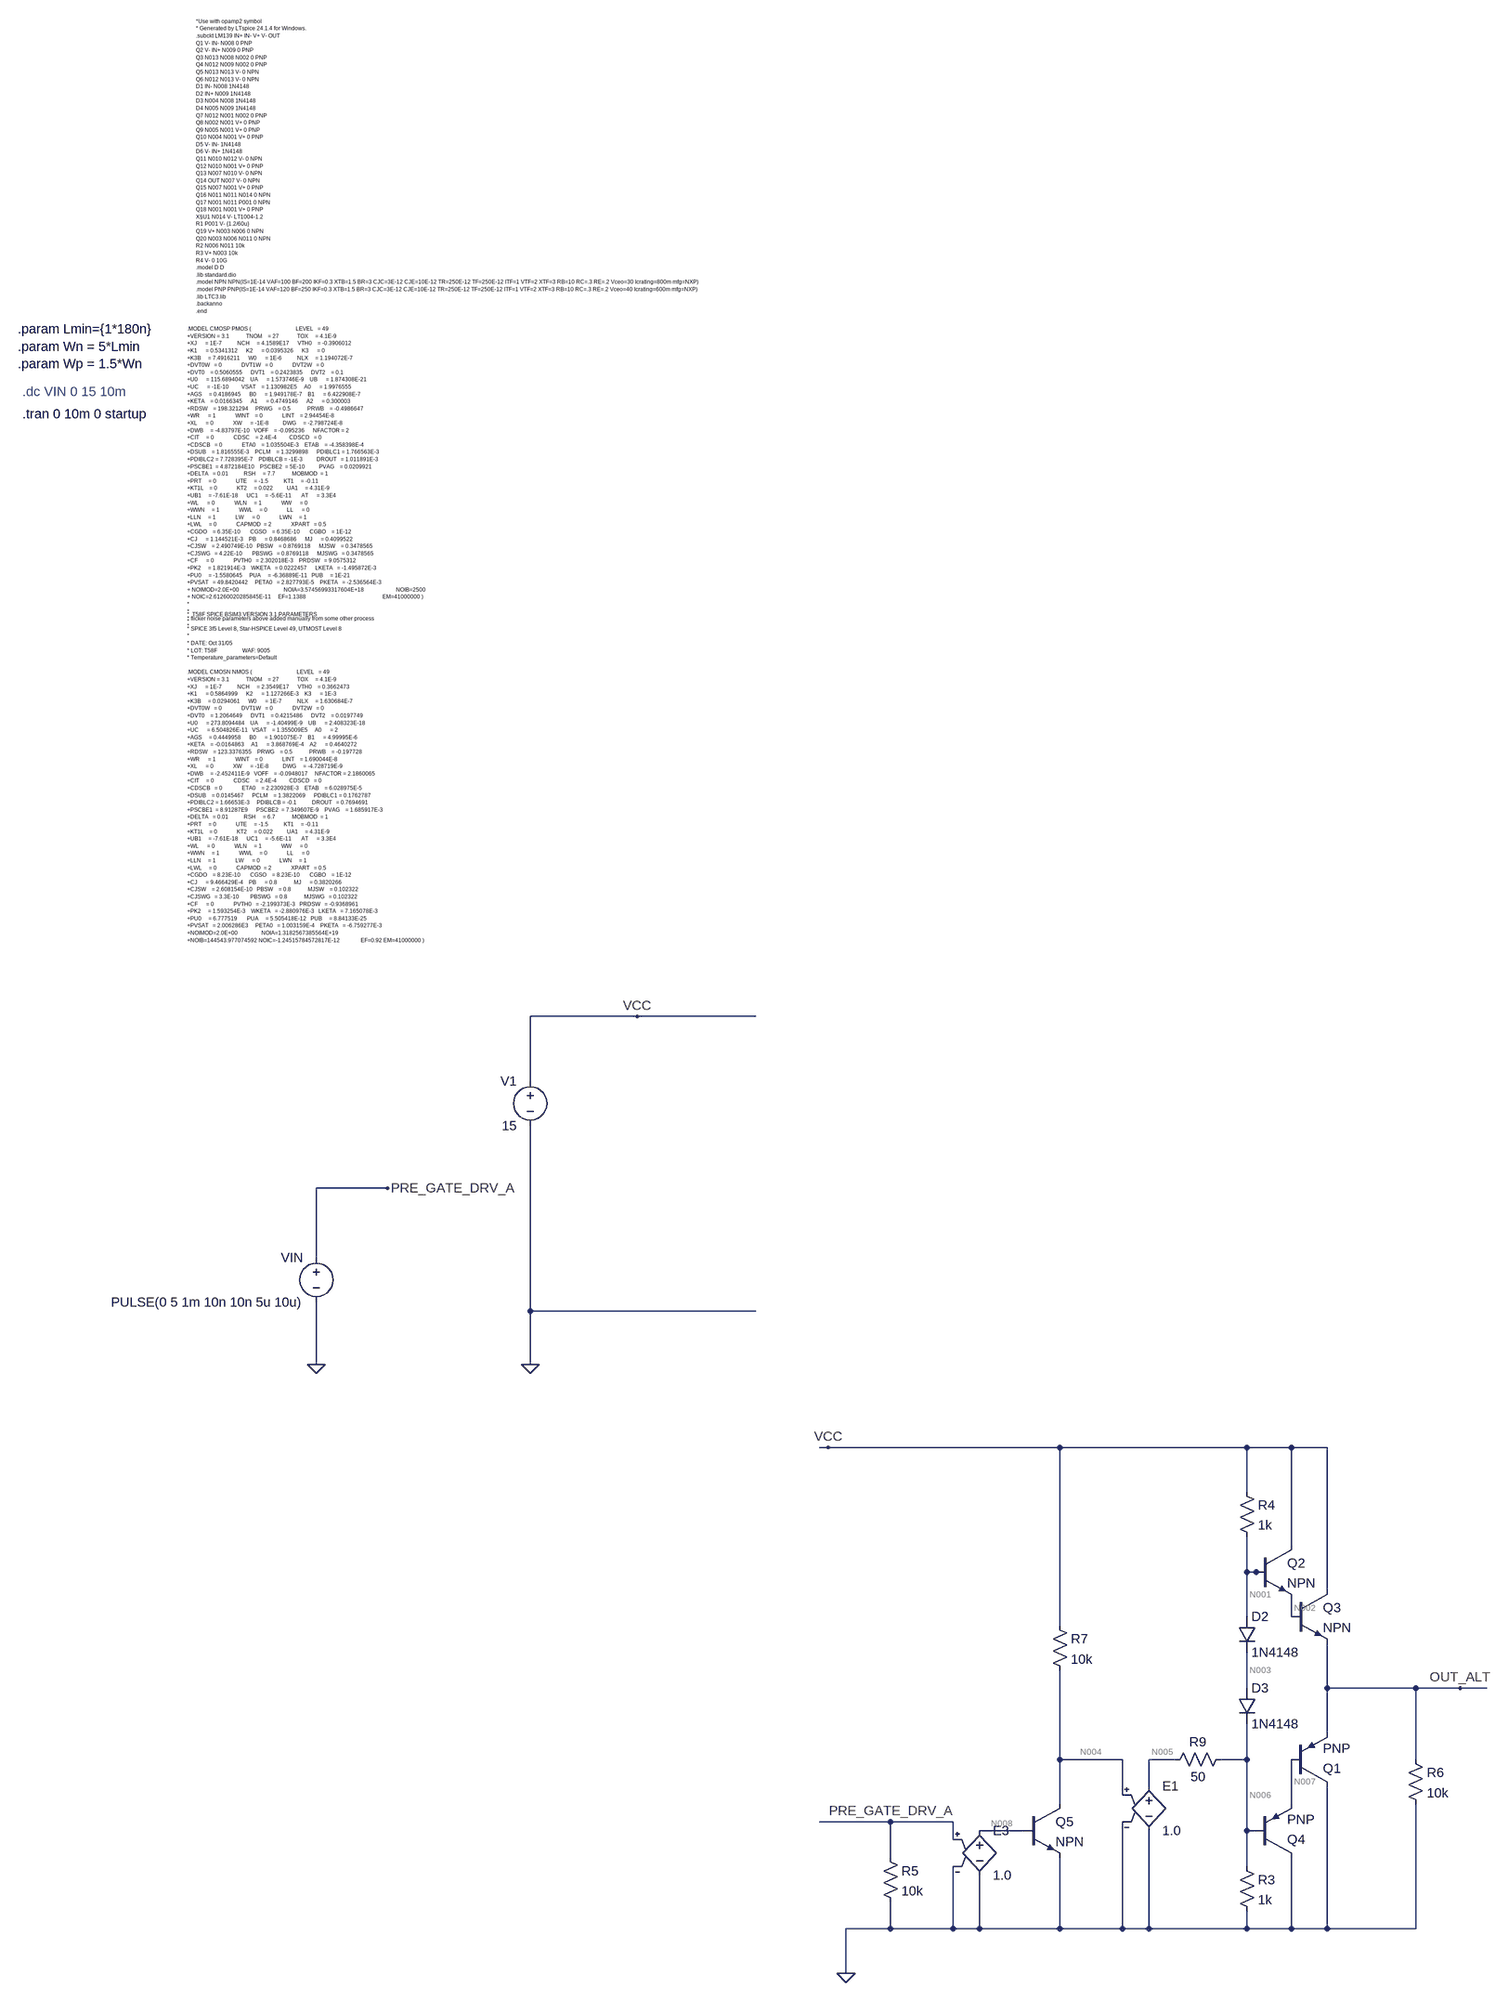
[diagram p0: schematic Output_Stage_Alternative.asc]
Output_Stage_Alternative.asc, the LTspice schematic file:
Version 4.1
SHEET 1 6960 2676
WIRE 672 480 480 480
WIRE 1008 480 672 480
WIRE 480 928 480 480
WIRE 224 1120 96 1120
WIRE 96 1248 96 1120
WIRE 480 1344 480 1008
WIRE 1008 1344 480 1344
WIRE 96 1440 96 1328
WIRE 480 1440 480 1344
WIRE 1760 1712 1744 1712
WIRE 2176 1712 1760 1712
WIRE 2512 1712 2176 1712
WIRE 2592 1712 2512 1712
WIRE 2656 1712 2592 1712
WIRE 2512 1792 2512 1712
WIRE 2592 1888 2592 1712
WIRE 2512 1936 2512 1872
WIRE 2528 1936 2512 1936
WIRE 2544 1936 2528 1936
WIRE 2656 1968 2656 1712
WIRE 2512 2016 2512 1936
WIRE 2592 2016 2592 1984
WIRE 2176 2032 2176 1712
WIRE 2512 2144 2512 2080
WIRE 2656 2144 2656 2064
WIRE 3008 2144 2656 2144
WIRE 3088 2144 3008 2144
WIRE 3136 2144 3088 2144
WIRE 2656 2224 2656 2144
WIRE 2176 2272 2176 2112
WIRE 2288 2272 2176 2272
WIRE 2384 2272 2336 2272
WIRE 2512 2272 2512 2208
WIRE 2512 2272 2464 2272
WIRE 3008 2272 3008 2144
WIRE 2336 2320 2336 2272
WIRE 2288 2336 2288 2272
WIRE 2176 2352 2176 2272
WIRE 2592 2352 2592 2272
WIRE 1872 2384 1744 2384
WIRE 1984 2384 1872 2384
WIRE 2112 2400 2032 2400
WIRE 2512 2400 2512 2272
WIRE 2528 2400 2512 2400
WIRE 1984 2416 1984 2384
WIRE 1872 2448 1872 2384
WIRE 2512 2464 2512 2400
WIRE 1872 2576 1872 2528
WIRE 1872 2576 1792 2576
WIRE 1984 2576 1984 2464
WIRE 1984 2576 1872 2576
WIRE 2032 2576 2032 2480
WIRE 2032 2576 1984 2576
WIRE 2176 2576 2176 2448
WIRE 2176 2576 2032 2576
WIRE 2288 2576 2288 2384
WIRE 2288 2576 2176 2576
WIRE 2336 2576 2336 2400
WIRE 2336 2576 2288 2576
WIRE 2512 2576 2512 2544
WIRE 2512 2576 2336 2576
WIRE 2592 2576 2592 2448
WIRE 2592 2576 2512 2576
WIRE 2656 2576 2656 2320
WIRE 2656 2576 2592 2576
WIRE 3008 2576 3008 2352
WIRE 3008 2576 2656 2576
WIRE 1792 2656 1792 2576
FLAG 480 1440 0
FLAG 96 1440 0
FLAG 224 1120 PRE_GATE_DRV_A
FLAG 672 480 VCC
FLAG 1872 2384 PRE_GATE_DRV_A
FLAG 3088 2144 OUT_ALT
FLAG 1792 2656 0
FLAG 1760 1712 VCC
SYMBOL voltage 480 912 M0
WINDOW 123 0 0 Left 0
WINDOW 39 0 0 Left 0
SYMATTR InstName V1
SYMATTR Value 15
SYMBOL voltage 96 1232 M0
WINDOW 123 0 0 Left 0
WINDOW 39 0 0 Left 0
SYMATTR InstName VIN
SYMATTR Value PULSE(0 5 1m 10n 10n 5u 10u)
SYMBOL npn 2528 1888 R0
SYMATTR InstName Q2
SYMBOL npn 2592 1968 R0
SYMATTR InstName Q3
SYMBOL diode 2496 2016 R0
SYMATTR InstName D2
SYMATTR Value 1N4148
SYMBOL e 2336 2304 R0
SYMATTR InstName E1
SYMATTR Value 1.0
SYMBOL res 1856 2432 R0
SYMATTR InstName R5
SYMATTR Value 10k
SYMBOL res 2992 2256 R0
SYMATTR InstName R6
SYMATTR Value 10k
SYMBOL pnp 2592 2320 M180
SYMATTR InstName Q1
SYMBOL pnp 2528 2448 M180
SYMATTR InstName Q4
SYMBOL diode 2496 2144 R0
SYMATTR InstName D3
SYMATTR Value 1N4148
SYMBOL res 2496 2448 R0
SYMATTR InstName R3
SYMATTR Value 1k
SYMBOL res 2496 1776 R0
SYMATTR InstName R4
SYMATTR Value 1k
SYMBOL npn 2112 2352 R0
SYMATTR InstName Q5
SYMBOL res 2160 2016 R0
SYMATTR InstName R7
SYMATTR Value 10k
SYMBOL e 2032 2384 R0
SYMATTR InstName E3
SYMATTR Value 1.0
SYMBOL res 2480 2256 R90
WINDOW 0 0 56 VBottom 2
WINDOW 3 32 56 VTop 2
SYMATTR InstName R9
SYMATTR Value 50
TEXT -136 -880 Left 0 !.MODEL CMOSP PMOS (                                LEVEL   = 49\n+VERSION = 3.1            TNOM    = 27             TOX     = 4.1E-9\n+XJ      = 1E-7           NCH     = 4.1589E17      VTH0    = -0.3906012\n+K1      = 0.5341312      K2      = 0.0395326      K3      = 0\n+K3B     = 7.4916211      W0      = 1E-6           NLX     = 1.194072E-7\n+DVT0W   = 0              DVT1W   = 0              DVT2W   = 0\n+DVT0    = 0.5060555      DVT1    = 0.2423835      DVT2    = 0.1\n+U0      = 115.6894042    UA      = 1.573746E-9    UB      = 1.874308E-21\n+UC      = -1E-10         VSAT    = 1.130982E5     A0      = 1.9976555\n+AGS     = 0.4186945      B0      = 1.949178E-7    B1      = 6.422908E-7\n+KETA    = 0.0166345      A1      = 0.4749146      A2      = 0.300003\n+RDSW    = 198.321294     PRWG    = 0.5            PRWB    = -0.4986647\n+WR      = 1              WINT    = 0              LINT    = 2.94454E-8\n+XL      = 0              XW      = -1E-8          DWG     = -2.798724E-8\n+DWB     = -4.83797E-10   VOFF    = -0.095236      NFACTOR = 2\n+CIT     = 0              CDSC    = 2.4E-4         CDSCD   = 0\n+CDSCB   = 0              ETA0    = 1.035504E-3    ETAB    = -4.358398E-4\n+DSUB    = 1.816555E-3    PCLM    = 1.3299898      PDIBLC1 = 1.766563E-3\n+PDIBLC2 = 7.728395E-7    PDIBLCB = -1E-3          DROUT   = 1.011891E-3\n+PSCBE1  = 4.872184E10    PSCBE2  = 5E-10          PVAG    = 0.0209921\n+DELTA   = 0.01           RSH     = 7.7            MOBMOD  = 1\n+PRT     = 0              UTE     = -1.5           KT1     = -0.11\n+KT1L    = 0              KT2     = 0.022          UA1     = 4.31E-9\n+UB1     = -7.61E-18      UC1     = -5.6E-11       AT      = 3.3E4\n+WL      = 0              WLN     = 1              WW      = 0\n+WWN     = 1              WWL     = 0              LL      = 0\n+LLN     = 1              LW      = 0              LWN     = 1\n+LWL     = 0              CAPMOD  = 2              XPART   = 0.5\n+CGDO    = 6.35E-10       CGSO    = 6.35E-10       CGBO    = 1E-12\n+CJ      = 1.144521E-3    PB      = 0.8468686      MJ      = 0.4099522\n+CJSW    = 2.490749E-10   PBSW    = 0.8769118      MJSW    = 0.3478565\n+CJSWG   = 4.22E-10       PBSWG   = 0.8769118      MJSWG   = 0.3478565\n+CF      = 0              PVTH0   = 2.302018E-3    PRDSW   = 9.0575312\n+PK2     = 1.821914E-3    WKETA   = 0.0222457      LKETA   = -1.495872E-3\n+PU0     = -1.5580645     PUA     = -6.36889E-11   PUB     = 1E-21\n+PVSAT   = 49.8420442     PETA0   = 2.827793E-5    PKETA   = -2.536564E-3 \n+ NOIMOD=2.0E+00                                NOIA=3.57456993317604E+18                       NOIB=2500\n+ NOIC=2.61260020285845E-11     EF=1.1388                                                       EM=41000000 )\n*\n*\n* flicker noise parameters above added manually from some other process\n*
TEXT -440 -880 Left 2 !.param Lmin={1*180n}\n.param Wn = 5*Lmin\n.param Wp = 1.5*Wn
TEXT -432 -768 Left 2 ;.dc VIN 0 15 10m
TEXT -432 -728 Left 2 !.tran 0 10m 0 startup
TEXT -136 -368 Left 0 !*  T58F SPICE BSIM3 VERSION 3.1 PARAMETERS\n* \n* SPICE 3f5 Level 8, Star-HSPICE Level 49, UTMOST Level 8\n* \n* DATE: Oct 31/05\n* LOT: T58F                  WAF: 9005\n* Temperature_parameters=Default\n \n.MODEL CMOSN NMOS (                                LEVEL   = 49\n+VERSION = 3.1            TNOM    = 27             TOX     = 4.1E-9\n+XJ      = 1E-7           NCH     = 2.3549E17      VTH0    = 0.3662473\n+K1      = 0.5864999      K2      = 1.127266E-3    K3      = 1E-3\n+K3B     = 0.0294061      W0      = 1E-7           NLX     = 1.630684E-7\n+DVT0W   = 0              DVT1W   = 0              DVT2W   = 0\n+DVT0    = 1.2064649      DVT1    = 0.4215486      DVT2    = 0.0197749\n+U0      = 273.8094484    UA      = -1.40499E-9    UB      = 2.408323E-18\n+UC      = 6.504826E-11   VSAT    = 1.355009E5     A0      = 2\n+AGS     = 0.4449958      B0      = 1.901075E-7    B1      = 4.99995E-6\n+KETA    = -0.0164863     A1      = 3.868769E-4    A2      = 0.4640272\n+RDSW    = 123.3376355    PRWG    = 0.5            PRWB    = -0.197728\n+WR      = 1              WINT    = 0              LINT    = 1.690044E-8\n+XL      = 0              XW      = -1E-8          DWG     = -4.728719E-9\n+DWB     = -2.452411E-9   VOFF    = -0.0948017     NFACTOR = 2.1860065\n+CIT     = 0              CDSC    = 2.4E-4         CDSCD   = 0\n+CDSCB   = 0              ETA0    = 2.230928E-3    ETAB    = 6.028975E-5\n+DSUB    = 0.0145467      PCLM    = 1.3822069      PDIBLC1 = 0.1762787\n+PDIBLC2 = 1.66653E-3     PDIBLCB = -0.1           DROUT   = 0.7694691\n+PSCBE1  = 8.91287E9      PSCBE2  = 7.349607E-9    PVAG    = 1.685917E-3\n+DELTA   = 0.01           RSH     = 6.7            MOBMOD  = 1\n+PRT     = 0              UTE     = -1.5           KT1     = -0.11\n+KT1L    = 0              KT2     = 0.022          UA1     = 4.31E-9\n+UB1     = -7.61E-18      UC1     = -5.6E-11       AT      = 3.3E4\n+WL      = 0              WLN     = 1              WW      = 0\n+WWN     = 1              WWL     = 0              LL      = 0\n+LLN     = 1              LW      = 0              LWN     = 1\n+LWL     = 0              CAPMOD  = 2              XPART   = 0.5\n+CGDO    = 8.23E-10       CGSO    = 8.23E-10       CGBO    = 1E-12\n+CJ      = 9.466429E-4    PB      = 0.8            MJ      = 0.3820266\n+CJSW    = 2.608154E-10   PBSW    = 0.8            MJSW    = 0.102322\n+CJSWG   = 3.3E-10        PBSWG   = 0.8            MJSWG   = 0.102322\n+CF      = 0              PVTH0   = -2.199373E-3   PRDSW   = -0.9368961\n+PK2     = 1.593254E-3    WKETA   = -2.880976E-3   LKETA   = 7.165078E-3\n+PU0     = 6.777519       PUA     = 5.505418E-12   PUB     = 8.84133E-25\n+PVSAT   = 2.006286E3     PETA0   = 1.003159E-4    PKETA   = -6.759277E-3\n+NOIMOD=2.0E+00                 NOIA=1.3182567385564E+19\n+NOIB=144543.977074592 NOIC=-1.24515784572817E-12               EF=0.92 EM=41000000 )
TEXT -120 -1432 Left 0 !*Use with opamp2 symbol\n* Generated by LTspice 24.1.4 for Windows.\n.subckt LM139 IN+ IN- V+ V- OUT\nQ1 V- IN- N008 0 PNP\nQ2 V- IN+ N009 0 PNP\nQ3 N013 N008 N002 0 PNP\nQ4 N012 N009 N002 0 PNP\nQ5 N013 N013 V- 0 NPN\nQ6 N012 N013 V- 0 NPN\nD1 IN- N008 1N4148\nD2 IN+ N009 1N4148\nD3 N004 N008 1N4148\nD4 N005 N009 1N4148\nQ7 N012 N001 N002 0 PNP\nQ8 N002 N001 V+ 0 PNP\nQ9 N005 N001 V+ 0 PNP\nQ10 N004 N001 V+ 0 PNP\nD5 V- IN- 1N4148\nD6 V- IN+ 1N4148\nQ11 N010 N012 V- 0 NPN\nQ12 N010 N001 V+ 0 PNP\nQ13 N007 N010 V- 0 NPN\nQ14 OUT N007 V- 0 NPN\nQ15 N007 N001 V+ 0 PNP\nQ16 N011 N011 N014 0 NPN\nQ17 N001 N011 P001 0 NPN\nQ18 N001 N001 V+ 0 PNP\nX§U1 N014 V- LT1004-1.2\nR1 P001 V- {1.2/60u}\nQ19 V+ N003 N006 0 NPN\nQ20 N003 N006 N011 0 NPN\nR2 N006 N011 10k\nR3 V+ N003 10k\nR4 V- 0 10G\n.model D D\n.lib standard.dio\n.model NPN NPN(IS=1E-14 VAF=100 BF=200 IKF=0.3 XTB=1.5 BR=3 CJC=3E-12 CJE=10E-12 TR=250E-12 TF=250E-12 ITF=1 VTF=2 XTF=3 RB=10 RC=.3 RE=.2 Vceo=30 Icrating=800m mfg=NXP)\n.model PNP PNP(IS=1E-14 VAF=120 BF=250 IKF=0.3 XTB=1.5 BR=3 CJC=3E-12 CJE=10E-12 TR=250E-12 TF=250E-12 ITF=1 VTF=2 XTF=3 RB=10 RC=.3 RE=.2 Vceo=40 Icrating=600m mfg=NXP)\n.lib LTC3.lib\n.backanno\n.end

The netlist it stands for:
* Output_Stage_Alternative.asc
V1 VCC 0 15
VIN PRE_GATE_DRV_A 0 PULSE(0 5 1m 10n 10n 5u 10u)
Q2 VCC N001 N002 0 NPN
Q3 VCC N002 OUT_ALT 0 NPN
D2 N001 N003 1N4148
E1 N005 0 N004 0 1.0
R5 PRE_GATE_DRV_A 0 10k
R6 OUT_ALT 0 10k
Q1 0 N007 OUT_ALT 0 PNP
Q4 0 N006 N007 0 PNP
D3 N003 N006 1N4148
R3 N006 0 1k
R4 VCC N001 1k
Q5 N004 N008 0 0 NPN
R7 VCC N004 10k
E3 N008 0 PRE_GATE_DRV_A 0 1.0
R9 N006 N005 50
.model D D
.lib standard.dio
.model NPN NPN
.model PNP PNP
.lib standard.bjt
.MODEL CMOSP PMOS (                                LEVEL   = 49
+VERSION = 3.1            TNOM    = 27             TOX     = 4.1E-9
+XJ      = 1E-7           NCH     = 4.1589E17      VTH0    = -0.3906012
+K1      = 0.5341312      K2      = 0.0395326      K3      = 0
+K3B     = 7.4916211      W0      = 1E-6           NLX     = 1.194072E-7
+DVT0W   = 0              DVT1W   = 0              DVT2W   = 0
+DVT0    = 0.5060555      DVT1    = 0.2423835      DVT2    = 0.1
+U0      = 115.6894042    UA      = 1.573746E-9    UB      = 1.874308E-21
+UC      = -1E-10         VSAT    = 1.130982E5     A0      = 1.9976555
+AGS     = 0.4186945      B0      = 1.949178E-7    B1      = 6.422908E-7
+KETA    = 0.0166345      A1      = 0.4749146      A2      = 0.300003
+RDSW    = 198.321294     PRWG    = 0.5            PRWB    = -0.4986647
+WR      = 1              WINT    = 0              LINT    = 2.94454E-8
+XL      = 0              XW      = -1E-8          DWG     = -2.798724E-8
+DWB     = -4.83797E-10   VOFF    = -0.095236      NFACTOR = 2
+CIT     = 0              CDSC    = 2.4E-4         CDSCD   = 0
+CDSCB   = 0              ETA0    = 1.035504E-3    ETAB    = -4.358398E-4
+DSUB    = 1.816555E-3    PCLM    = 1.3299898      PDIBLC1 = 1.766563E-3
+PDIBLC2 = 7.728395E-7    PDIBLCB = -1E-3          DROUT   = 1.011891E-3
+PSCBE1  = 4.872184E10    PSCBE2  = 5E-10          PVAG    = 0.0209921
+DELTA   = 0.01           RSH     = 7.7            MOBMOD  = 1
+PRT     = 0              UTE     = -1.5           KT1     = -0.11
+KT1L    = 0              KT2     = 0.022          UA1     = 4.31E-9
+UB1     = -7.61E-18      UC1     = -5.6E-11       AT      = 3.3E4
+WL      = 0              WLN     = 1              WW      = 0
+WWN     = 1              WWL     = 0              LL      = 0
+LLN     = 1              LW      = 0              LWN     = 1
+LWL     = 0              CAPMOD  = 2              XPART   = 0.5
+CGDO    = 6.35E-10       CGSO    = 6.35E-10       CGBO    = 1E-12
+CJ      = 1.144521E-3    PB      = 0.8468686      MJ      = 0.4099522
+CJSW    = 2.490749E-10   PBSW    = 0.8769118      MJSW    = 0.3478565
+CJSWG   = 4.22E-10       PBSWG   = 0.8769118      MJSWG   = 0.3478565
+CF      = 0              PVTH0   = 2.302018E-3    PRDSW   = 9.0575312
+PK2     = 1.821914E-3    WKETA   = 0.0222457      LKETA   = -1.495872E-3
+PU0     = -1.5580645     PUA     = -6.36889E-11   PUB     = 1E-21
+PVSAT   = 49.8420442     PETA0   = 2.827793E-5    PKETA   = -2.536564E-3
+ NOIMOD=2.0E+00                                NOIA=3.57456993317604E+18                       NOIB=2500
+ NOIC=2.61260020285845E-11     EF=1.1388                                                       EM=41000000 )
*
*
* flicker noise parameters above added manually from some other process
*
.param Lmin={1*180n}
.param Wn = 5*Lmin
.param Wp = 1.5*Wn
* .dc VIN 0 15 10m
.tran 0 10m 0 startup
*  T58F SPICE BSIM3 VERSION 3.1 PARAMETERS
*
* SPICE 3f5 Level 8, Star-HSPICE Level 49, UTMOST Level 8
*
* DATE: Oct 31/05
* LOT: T58F                  WAF: 9005
* Temperature_parameters=Default
.MODEL CMOSN NMOS (                                LEVEL   = 49
+VERSION = 3.1            TNOM    = 27             TOX     = 4.1E-9
+XJ      = 1E-7           NCH     = 2.3549E17      VTH0    = 0.3662473
+K1      = 0.5864999      K2      = 1.127266E-3    K3      = 1E-3
+K3B     = 0.0294061      W0      = 1E-7           NLX     = 1.630684E-7
+DVT0W   = 0              DVT1W   = 0              DVT2W   = 0
+DVT0    = 1.2064649      DVT1    = 0.4215486      DVT2    = 0.0197749
+U0      = 273.8094484    UA      = -1.40499E-9    UB      = 2.408323E-18
+UC      = 6.504826E-11   VSAT    = 1.355009E5     A0      = 2
+AGS     = 0.4449958      B0      = 1.901075E-7    B1      = 4.99995E-6
+KETA    = -0.0164863     A1      = 3.868769E-4    A2      = 0.4640272
+RDSW    = 123.3376355    PRWG    = 0.5            PRWB    = -0.197728
+WR      = 1              WINT    = 0              LINT    = 1.690044E-8
+XL      = 0              XW      = -1E-8          DWG     = -4.728719E-9
+DWB     = -2.452411E-9   VOFF    = -0.0948017     NFACTOR = 2.1860065
+CIT     = 0              CDSC    = 2.4E-4         CDSCD   = 0
+CDSCB   = 0              ETA0    = 2.230928E-3    ETAB    = 6.028975E-5
+DSUB    = 0.0145467      PCLM    = 1.3822069      PDIBLC1 = 0.1762787
+PDIBLC2 = 1.66653E-3     PDIBLCB = -0.1           DROUT   = 0.7694691
+PSCBE1  = 8.91287E9      PSCBE2  = 7.349607E-9    PVAG    = 1.685917E-3
+DELTA   = 0.01           RSH     = 6.7            MOBMOD  = 1
+PRT     = 0              UTE     = -1.5           KT1     = -0.11
+KT1L    = 0              KT2     = 0.022          UA1     = 4.31E-9
+UB1     = -7.61E-18      UC1     = -5.6E-11       AT      = 3.3E4
+WL      = 0              WLN     = 1              WW      = 0
+WWN     = 1              WWL     = 0              LL      = 0
+LLN     = 1              LW      = 0              LWN     = 1
+LWL     = 0              CAPMOD  = 2              XPART   = 0.5
+CGDO    = 8.23E-10       CGSO    = 8.23E-10       CGBO    = 1E-12
+CJ      = 9.466429E-4    PB      = 0.8            MJ      = 0.3820266
+CJSW    = 2.608154E-10   PBSW    = 0.8            MJSW    = 0.102322
+CJSWG   = 3.3E-10        PBSWG   = 0.8            MJSWG   = 0.102322
+CF      = 0              PVTH0   = -2.199373E-3   PRDSW   = -0.9368961
+PK2     = 1.593254E-3    WKETA   = -2.880976E-3   LKETA   = 7.165078E-3
+PU0     = 6.777519       PUA     = 5.505418E-12   PUB     = 8.84133E-25
+PVSAT   = 2.006286E3     PETA0   = 1.003159E-4    PKETA   = -6.759277E-3
+NOIMOD=2.0E+00                 NOIA=1.3182567385564E+19
+NOIB=144543.977074592 NOIC=-1.24515784572817E-12               EF=0.92 EM=41000000 )
*Use with opamp2 symbol
* Generated by LTspice 24.1.4 for Windows.
.subckt LM139 IN+ IN- V+ V- OUT
Q1 V- IN- N008 0 PNP
Q2 V- IN+ N009 0 PNP
Q3 N013 N008 N002 0 PNP
Q4 N012 N009 N002 0 PNP
Q5 N013 N013 V- 0 NPN
Q6 N012 N013 V- 0 NPN
D1 IN- N008 1N4148
D2 IN+ N009 1N4148
D3 N004 N008 1N4148
D4 N005 N009 1N4148
Q7 N012 N001 N002 0 PNP
Q8 N002 N001 V+ 0 PNP
Q9 N005 N001 V+ 0 PNP
Q10 N004 N001 V+ 0 PNP
D5 V- IN- 1N4148
D6 V- IN+ 1N4148
Q11 N010 N012 V- 0 NPN
Q12 N010 N001 V+ 0 PNP
Q13 N007 N010 V- 0 NPN
Q14 OUT N007 V- 0 NPN
Q15 N007 N001 V+ 0 PNP
Q16 N011 N011 N014 0 NPN
Q17 N001 N011 P001 0 NPN
Q18 N001 N001 V+ 0 PNP
X§U1 N014 V- LT1004-1.2
R1 P001 V- {1.2/60u}
Q19 V+ N003 N006 0 NPN
Q20 N003 N006 N011 0 NPN
R2 N006 N011 10k
R3 V+ N003 10k
R4 V- 0 10G
.model D D
.lib standard.dio
.model NPN NPN(IS=1E-14 VAF=100 BF=200 IKF=0.3 XTB=1.5 BR=3 CJC=3E-12 CJE=10E-12 TR=250E-12 TF=250E-12 ITF=1 VTF=2 XTF=3 RB=10 RC=.3 RE=.2 Vceo=30 Icrating=800m mfg=NXP)
.model PNP PNP(IS=1E-14 VAF=120 BF=250 IKF=0.3 XTB=1.5 BR=3 CJC=3E-12 CJE=10E-12 TR=250E-12 TF=250E-12 ITF=1 VTF=2 XTF=3 RB=10 RC=.3 RE=.2 Vceo=40 Icrating=600m mfg=NXP)
.lib LTC3.lib
.backanno
.end
.backanno
.end